# Altium project LM5161 Buck Converter_12Vout.PrjPcb (part 2 of 2)
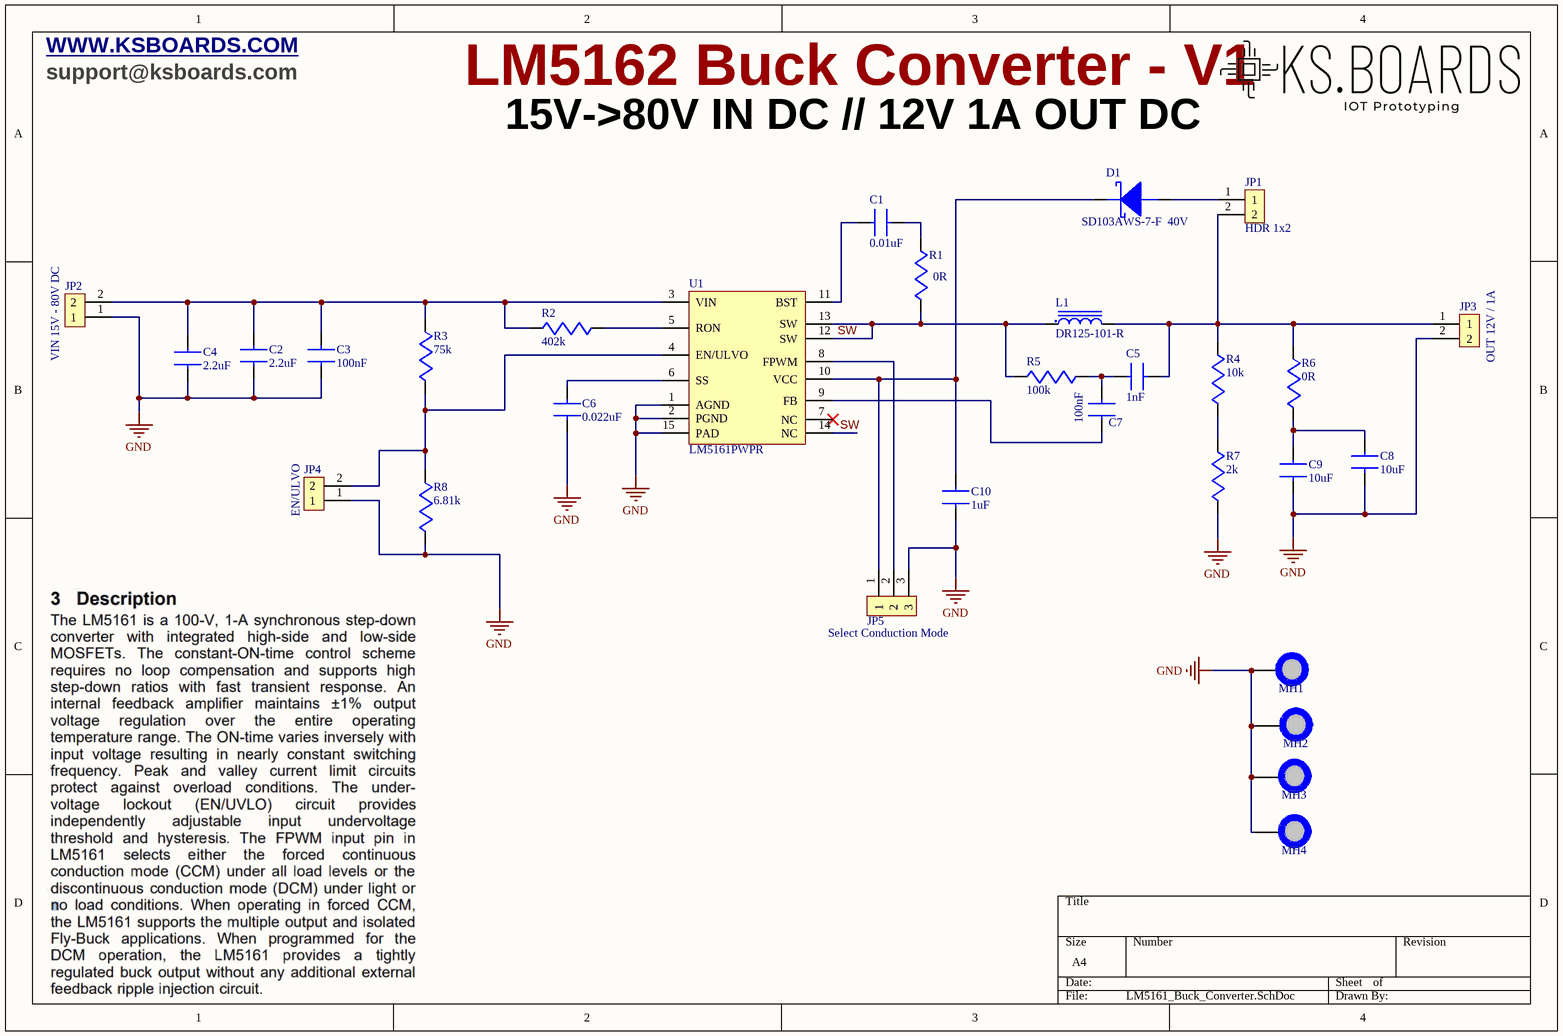
[diagram p1: LM5161_Buck_Converter.SchDoc]

## Sheet LM5161_Buck_Converter.SchDoc (continued)

### Library data of the parts
C1 = C0603X103K5RACTU: KEMET - C0603X103K5RACTU - SMD Multilayer Ceramic Capacitor, FT-CAP, 10000 pF, 50 V, 0603 [1608 Metric], ± 10%, X7R; Capacitance: 10nF; Voltage Rating: 50V; Dissipation Factor: 2.5%; Supplier 1: Digi-Key; Supplier Part Number 1: 399-5346-1-ND; Manufacturer: KEMET; Manufacturer Part Number: C0603X103K5RACTU; RoHS: Yes; Category: Ceramic Capacitors; Stock 1: 40616; Pricing 1: 1=0,36000, 10=0,25000, 50=0,17520, 100=0,15020, 500=0,11262, 1000=0,09510 (USD); Mount: Surface Mount,PCB; Case/Package: 0603; Number of Pins: 2; Case Code (Imperial): 0603; Case Code (Metric): 1608; Dielectric Material: Ceramic; Min Operating Temperature: -55°C; Max Operating Temperature: 125°C; Tolerance: 10%; Packaging: Tape and Reel; Package Quantity: 1; Dielectric: X7R; Voltage Rating (DC): 50V; Termination: SMD/SMT; Series: C0603X; Voltage: 50V; Construction: Flat; Features: Soft Termination; Length: 1.6mm; Width: 0.8mm; Height: 0.8mm; Depth: 0.8mm; Thickness: 0.034inch; Radiation Hardening: No; RoHS Compliant: Yes; REACH SVHC: No SVHC; ComponentLink1URL: https://datasheet.ciiva.com/22700/kem-c1002-x7r-smd-22700565.pdf?src-supplier=Element14; ComponentLink1Description: https://datasheet.ciiva.com/22700/kem-c1002-x7r-smd-22700565.pdf?src-supplier=Element14; ComponentLink2URL: https://datasheet.ciiva.com/28610/1918693-28610825.pdf?src-supplier=Element14; ComponentLink2Description: https://datasheet.ciiva.com/28610/1918693-28610825.pdf?src-supplier=Element14; ComponentLink3URL: https://datasheet.ciiva.com/14604/70096394-14604427.pdf?src-supplier=Allied+Electronics; ComponentLink3Description: https://datasheet.ciiva.com/14604/70096394-14604427.pdf?src-supplier=Allied+Electronics; ComponentLink4URL: https://datasheet.ciiva.com/5904/kem-c1002-x7r-smd-5904908.pdf?src-supplier=Farnell; ComponentLink4Description: https://datasheet.ciiva.com/5904/kem-c1002-x7r-smd-5904908.pdf?src-supplier=Farnell; ComponentLink5URL: https://datasheet.ciiva.com/18193/getdatasheetpartid-571854-18193228.pdf?src-supplier=Verical; ComponentLink5Description: https://datasheet.ciiva.com/18193/getdatasheetpartid-571854-18193228.pdf?src-supplier=Verical; ComponentLink6URL: https://datasheet.ciiva.com/26847/getdatasheetpartid-385605-26847756.pdf?src-supplier=Verical; ComponentLink6Description: https://datasheet.ciiva.com/26847/getdatasheetpartid-385605-26847756.pdf?src-supplier=Verical
C2 C4 = C0603C225K4PACTU: KEMET C0603C225K4PACTU - CAP, MLCC, X5R, 2.2UF, 16V, 0603; Dielectric Material: Ceramic; Tolerance: 10%; Dissipation Factor: 5%; Supplier 1: Digi-Key; Supplier Part Number 1: 399-7886-1-ND; Manufacturer: KEMET; Manufacturer Part Number: C0603C225K4PACTU; RoHS: Yes; Category: Ceramic Capacitors; Stock 1: 245025; Pricing 1: 1=0,13000, 10=0,09000, 50=0,05080, 100=0,04210, 500=0,02952, 1000=0,02444 (USD); Mount: Surface Mount; Case/Package: 0603; Number of Pins: 2; Case Code (Imperial): 0603; Case Code (Metric): 1608; Contact Plating: Tin,Matte; Min Operating Temperature: -55°C; Max Operating Temperature: 85°C; Capacitance: 2.2uF; Voltage Rating (DC): 16V; Packaging: Tape and Reel; Voltage Rating: 16V; Package Quantity: 1; Termination: SMD/SMT; Dielectric: X5R; Voltage: 16V; Series: C; Construction: Flat; Length: 1.6mm; Width: 0.8mm; Height: 0.8mm; Depth: 0.8mm; Thickness: 0.034inch; Radiation Hardening: No; REACH SVHC: No SVHC; RoHS Compliant: Yes; Lead Free: Lead Free; ComponentLink1URL: https://datasheet.ciiva.com/5969/1776083-5969304.pdf?src-supplier=Farnell; ComponentLink1Description: https://datasheet.ciiva.com/5969/1776083-5969304.pdf?src-supplier=Farnell; ComponentLink2URL: https://datasheet.ciiva.com/7823/1776083-7823706.pdf?src-supplier=Element14; ComponentLink2Description: https://datasheet.ciiva.com/7823/1776083-7823706.pdf?src-supplier=Element14
C3 C7 = CC0603KRX7R9BB104: CAPACITOR CERAMIC, 0.1UF, 50V, X7R, 10%, 0603; Manufacturer: Yageo; Supplier 1: Digi-Key; Supplier Part Number 1: 311-1344-1-ND; Manufacturer Part Number: CC0603KRX7R9BB104; RoHS: Yes; Category: Ceramic Capacitors; Stock 1: 8863982; Pricing 1: 1=0,10000, 10=0,05900, 50=0,03240, 100=0,02640, 500=0,01886, 1000=0,01482 (USD); Mount: Surface Mount; Case/Package: 0603; Number of Pins: 2; Case Code (Metric): 1608; Case Code (Imperial): 0603; Dielectric Material: Ceramic; Min Operating Temperature: -55°C; Max Operating Temperature: 125°C; Package Quantity: 1; Capacitance: 100nF; Voltage Rating: 50V; Tolerance: 10%; Packaging: Tape and Reel; Dielectric: X7R; Voltage: 50V; Termination: SMD/SMT; Series: CC; Length: 1.6mm; Width: 0.031inch; Height: 0.8mm; Thickness: 0.035inch; Depth: 0.8mm; Radiation Hardening: No; RoHS Compliant: Yes; Lead Free: Lead Free; REACH SVHC: No SVHC; Halogen Free: Halogen Free; ComponentLink1URL: https://datasheet.ciiva.com/11786/0900766b80d84f1d-11786061.pdf?src-supplier=RSComponents; ComponentLink1Description: https://datasheet.ciiva.com/11786/0900766b80d84f1d-11786061.pdf?src-supplier=RSComponents; ComponentLink2URL: https://datasheet.ciiva.com/144/mlccorderingcode-144176.pdf?src-supplier=Digi-Key; ComponentLink2Description: https://datasheet.ciiva.com/144/mlccorderingcode-144176.pdf?src-supplier=Digi-Key; ComponentLink3URL: https://datasheet.ciiva.com/144/mlccorderingcode-144177.pdf?src-supplier=Digi-Key; ComponentLink3Description: https://datasheet.ciiva.com/144/mlccorderingcode-144177.pdf?src-supplier=Digi-Key; ComponentLink4URL: https://datasheet.ciiva.com/144/mlccorderingcode-144178.pdf?src-supplier=Digi-Key; ComponentLink4Description: https://datasheet.ciiva.com/144/mlccorderingcode-144178.pdf?src-supplier=Digi-Key; ComponentLink5URL: https://datasheet.ciiva.com/7978/1489800-7978166.pdf?src-supplier=Element14; ComponentLink5Description: https://datasheet.ciiva.com/7978/1489800-7978166.pdf?src-supplier=Element14; ComponentLink6URL: https://datasheet.ciiva.com/16625/upy-gphc-x7r-6-3v-to-50v-8-16625530.pdf?src-supplier=Avnet+Europe; ComponentLink6Description: https://datasheet.ciiva.com/16625/upy-gphc-x7r-6-3v-to-50v-8-16625530.pdf?src-supplier=Avnet+Europe; ComponentLink7URL: https://datasheet.ciiva.com/8033/70765-8033819.pdf?src-supplier=Element14; ComponentLink7Description: https://datasheet.ciiva.com/8033/70765-8033819.pdf?src-supplier=Element14; ComponentLink8URL: https://datasheet.ciiva.com/8033/70765-8033821.pdf?src-supplier=Element14; ComponentLink8Description: https://datasheet.ciiva.com/8033/70765-8033821.pdf?src-supplier=Element14; ComponentLink9URL: https://datasheet.ciiva.com/22749/1489800-22749214.pdf?src-supplier=Element14; ComponentLink9Description: https://datasheet.ciiva.com/22749/1489800-22749214.pdf?src-supplier=Element14; ComponentLink10URL: https://datasheet.ciiva.com/31394/1489800-31394927.pdf?src-supplier=Farnell; ComponentLink10Description: https://datasheet.ciiva.com/31394/1489800-31394927.pdf?src-supplier=Farnell
C5 = C0603C102K5RACTU: KEMET - C0603C102K5RACTU - SMD Multilayer Ceramic Capacitor, 1000 pF, 50 V, 0603 [1608 Metric], ± 10%, X7R, C Series KEMET; Voltage Rating: 50V; Dissipation Factor: 2.5%; Supplier 1: Digi-Key; Supplier Part Number 1: 399-1082-1-ND; Manufacturer: KEMET; Manufacturer Part Number: C0603C102K5RACTU; RoHS: Yes; Category: Ceramic Capacitors; Stock 1: 888320; Pricing 1: 1=0,10000, 10=0,06100, 50=0,03320, 100=0,02700, 500=0,01932, 1000=0,01518 (USD); Mount: Surface Mount,PCB; Case/Package: 0603; Number of Pins: 2; Case Code (Imperial): 0603; Case Code (Metric): 1608; Dielectric Material: Ceramic; Contact Plating: Tin,Matte; Min Operating Temperature: -55°C; Max Operating Temperature: 125°C; Capacitance: 1nF; Tolerance: 10%; Packaging: Tape and Reel; Package Quantity: 1; Voltage Rating (DC): 50V; Termination: SMD/SMT; Dielectric: X7R; Series: C; Voltage: 50V; Construction: Flat; Length: 1.6mm; Width: 0.8mm; Height: 0.8mm; Thickness: 0.034inch; Depth: 0.8mm; Lead Pitch: 0.7mm; Radiation Hardening: No; RoHS Compliant: Yes; REACH SVHC: No SVHC; ComponentLink1URL: https://datasheet.ciiva.com/14589/70095383-14589013.pdf?src-supplier=Allied+Electronics; ComponentLink1Description: https://datasheet.ciiva.com/14589/70095383-14589013.pdf?src-supplier=Allied+Electronics; ComponentLink2URL: https://datasheet.ciiva.com/18192/getdatasheetpartid-110033-18192647.pdf?src-supplier=Verical; ComponentLink2Description: https://datasheet.ciiva.com/18192/getdatasheetpartid-110033-18192647.pdf?src-supplier=Verical; ComponentLink3URL: https://datasheet.ciiva.com/22749/1918693-22749719.pdf?src-supplier=Element14; ComponentLink3Description: https://datasheet.ciiva.com/22749/1918693-22749719.pdf?src-supplier=Element14; ComponentLink4URL: https://datasheet.ciiva.com/14586/70095383-14586057.pdf?src-supplier=Allied+Electronics; ComponentLink4Description: https://datasheet.ciiva.com/14586/70095383-14586057.pdf?src-supplier=Allied+Electronics; ComponentLink5URL: https://datasheet.ciiva.com/28645/1851736-28645563.pdf?src-supplier=Element14; ComponentLink5Description: https://datasheet.ciiva.com/28645/1851736-28645563.pdf?src-supplier=Element14
C6 = C0603C223K4RACTU: Cap Ceramic 0.022uF 16V X7R 10% SMD 0603 125°C Paper T/R; Manufacturer: KEMET; Capacitance: 22nF; Supplier 1: Digi-Key; Supplier Part Number 1: 399-1093-1-ND; Manufacturer Part Number: C0603C223K4RACTU; RoHS: Yes; Category: Ceramic Capacitors; Stock 1: 127241; Pricing 1: 1=0,10000, 10=0,06300, 50=0,03440, 100=0,02820, 500=0,02012, 1000=0,01581 (USD); Mount: Surface Mount; Case/Package: 0603; Case Code (Imperial): 0603; Case Code (Metric): 1608; Weight: 7.1E-05oz; Min Operating Temperature: -55°C; Max Operating Temperature: 125°C; Packaging: Tape and Reel; Tolerance: 10%; Voltage Rating: 16V; Package Quantity: 1; Dielectric: X7R; Voltage Rating (DC): 16V; Termination: SMD/SMT; Series: C; Construction: Flat; Length: 1.6mm; Width: 0.8mm; Height: 0.8mm; Thickness: 0.034inch; Depth: 0.8mm; Radiation Hardening: No; RoHS Compliant: Yes; REACH SVHC: No SVHC; ComponentLink1URL: https://datasheet.ciiva.com/26847/getdatasheetpartid-724406-26847612.pdf?src-supplier=Verical; ComponentLink1Description: https://datasheet.ciiva.com/26847/getdatasheetpartid-724406-26847612.pdf?src-supplier=Verical; ComponentLink2URL: https://datasheet.ciiva.com/14599/70095383-14599397.pdf?src-supplier=Allied+Electronics; ComponentLink2Description: https://datasheet.ciiva.com/14599/70095383-14599397.pdf?src-supplier=Allied+Electronics; ComponentLink3URL: https://datasheet.ciiva.com/49516/1636924-49516646.pdf?src-supplier=Jameco; ComponentLink3Description: https://datasheet.ciiva.com/49516/1636924-49516646.pdf?src-supplier=Jameco; ComponentLink4URL: https://datasheet.ciiva.com/14601/70095383-14601245.pdf?src-supplier=Allied+Electronics; ComponentLink4Description: https://datasheet.ciiva.com/14601/70095383-14601245.pdf?src-supplier=Allied+Electronics
C8 C9 = C0603C106M9PACTU: KEMET - C0603C106M9PACTU - CAP, MLCC, X5R, 10UF, 6.3V, 0603; Dielectric Material: Ceramic; Tolerance: 20%; Supplier 1: Digi-Key; Supplier Part Number 1: 399-5504-1-ND; Manufacturer: KEMET; Manufacturer Part Number: C0603C106M9PACTU; RoHS: Yes; Category: Ceramic Capacitors; Stock 1: 524749; Pricing 1: 1=0,32000, 10=0,22000, 50=0,14680, 100=0,12470, 500=0,08804, 1000=0,07704 (USD); Mount: PCB,Surface Mount; Case/Package: 0603; Number of Pins: 2; Case Code (Imperial): 0603; Case Code (Metric): 1608; Min Operating Temperature: -55°C; Max Operating Temperature: 85°C; Capacitance: 10uF; Packaging: Tape and Reel; Voltage: 6.3V; Termination: SMD/SMT; Package Quantity: 4000; Voltage Rating: 6.3V; Voltage Rating (DC): 6.3V; Series: C0603C; Dielectric: X5R; Construction: Flat; Length: 1.6mm; Height: 0.8mm; Depth: 0.8mm; Radiation Hardening: No; REACH SVHC: No SVHC; RoHS Compliant: Yes; ComponentLink1URL: http://www.farnell.com/datasheets/2739682.pdf?src-supplier=Farnell; ComponentLink1Description: http://www.farnell.com/datasheets/2739682.pdf?src-supplier=Farnell; ComponentLink2URL: http://uk.rs-online.com/webdocs/1515/0900766b8151511d.pdf?src-supplier=RSComponents; ComponentLink2Description: http://uk.rs-online.com/webdocs/1515/0900766b8151511d.pdf?src-supplier=RSComponents; ComponentLink3URL: http://www.farnell.com/datasheets/1918694.pdf?src-supplier=Farnell; ComponentLink3Description: http://www.farnell.com/datasheets/1918694.pdf?src-supplier=Farnell; ComponentLink4URL: http://components.arrow.com/part/dataview/0323_00011321?src-supplier=Arrow+Europe; ComponentLink4Description: http://components.arrow.com/part/dataview/0323_00011321?src-supplier=Arrow+Europe; ComponentLink5URL: https://www.verical.com/server-webapp/html/getDatasheet?partID=353664&src-supplier=Verical; ComponentLink5Description: https://www.verical.com/server-webapp/html/getDatasheet?partID=353664&src-supplier=Verical; ComponentLink6URL: http://components.arrow.com/part/dataview/42932973S8313645N7429?src-supplier=Arrow+Electronics; ComponentLink6Description: http://components.arrow.com/part/dataview/42932973S8313645N7429?src-supplier=Arrow+Electronics; ComponentLink7URL: http://www.farnell.com/datasheets/2315129.pdf?src-supplier=Allied+Electronics; ComponentLink7Description: http://www.farnell.com/datasheets/2315129.pdf?src-supplier=Allied+Electronics; ComponentLink8URL: http://www.farnell.com/datasheets/2315129.pdf?src-supplier=RSComponents; ComponentLink8Description: http://www.farnell.com/datasheets/2315129.pdf?src-supplier=RSComponents; ComponentLink9URL: https://api.kemet.com/component-edge/download/datasheet/C0603C106M9PACTU.pdf?src-supplier=Digi-Key; ComponentLink9Description: https://api.kemet.com/component-edge/download/datasheet/C0603C106M9PACTU.pdf?src-supplier=Digi-Key; ComponentLink10URL: http://www.kemet.com/kemet/web/homepage/kechome.nsf/weben/ADB5E2666EC6BA90CA2570A50016092E/$file/KEM_C1005_Y5V_SMD.pdf?src-supplier=Avnet; ComponentLink10Description: http://www.kemet.com/kemet/web/homepage/kechome.nsf/weben/ADB5E2666EC6BA90CA2570A50016092E/$file/KEM_C1005_Y5V_SMD.pdf?src-supplier=Avnet; ComponentLink11URL: http://www.farnell.com/datasheets/2315129.pdf?src-supplier=Verical; ComponentLink11Description: http://www.farnell.com/datasheets/2315129.pdf?src-supplier=Verical; ComponentLink12URL: http://www.farnell.com/datasheets/2739682.pdf?src-supplier=Newark; ComponentLink12Description: http://www.farnell.com/datasheets/2739682.pdf?src-supplier=Newark; ComponentLink13URL: http://www.farnell.com/datasheets/2739682.pdf?src-supplier=Element14; ComponentLink13Description: http://www.farnell.com/datasheets/2739682.pdf?src-supplier=Element14; ComponentLink14URL: http://www.farnell.com/datasheets/2315129.pdf?src-supplier=Distrelec; ComponentLink14Description: http://www.farnell.com/datasheets/2315129.pdf?src-supplier=Distrelec; ComponentLink15URL: http://www.farnell.com/datasheets/2315129.pdf?src-supplier=Avnet+Asia; ComponentLink15Description: http://www.farnell.com/datasheets/2315129.pdf?src-supplier=Avnet+Asia; ComponentLink16URL: http://www.farnell.com/datasheets/2315129.pdf?src-supplier=Mouser; ComponentLink16Description: http://www.farnell.com/datasheets/2315129.pdf?src-supplier=Mouser; ComponentLink17URL: http://www.kemet.com/kemet/web/homepage/kechome.nsf/file/Commercial%20Ceramic%20Chips%20X5R%20Dielectric/$file/KEM_C1006_X5R_SMD.pdf?src-supplier=Element14; ComponentLink17Description: http://www.kemet.com/kemet/web/homepage/kechome.nsf/file/Commercial%20Ceramic%20Chips%20X5R%20Dielectric/$file/KEM_C1006_X5R_SMD.pdf?src-supplier=Element14; ComponentLink18URL: http://capacitoredge.kemet.com/capedge2/DataSheet?pn=C0603C106M9PAC7867&src-supplier=Avnet; ComponentLink18Description: http://capacitoredge.kemet.com/capedge2/DataSheet?pn=C0603C106M9PAC7867&src-supplier=Avnet; ComponentLink19URL: http://www.farnell.com/datasheets/2315129.pdf?src-supplier=Quest; ComponentLink19Description: http://www.farnell.com/datasheets/2315129.pdf?src-supplier=Quest; ComponentLink20URL: http://www.farnell.com/datasheets/2315129.pdf?src-supplier=TTI; ComponentLink20Description: http://www.farnell.com/datasheets/2315129.pdf?src-supplier=TTI; ComponentLink21URL: http://www.farnell.com/datasheets/2315129.pdf?src-supplier=TME; ComponentLink21Description: http://www.farnell.com/datasheets/2315129.pdf?src-supplier=TME
C10 = C0603C105K3PACTU: KEMET - C0603C105K3PACTU - SMD Multilayer Ceramic Capacitor, 1 µF, 25 V, 0603 [1608 Metric], ± 10%, X5R, C Series KEMET; Voltage Rating: 25V; Supplier 1: Digi-Key; Supplier Part Number 1: 399-7846-1-ND; Manufacturer: KEMET; Manufacturer Part Number: C0603C105K3PACTU; RoHS: Yes; Category: Ceramic Capacitors; Stock 1: 91592; Pricing 1: 1=0,19000, 10=0,13300, 50=0,07540, 100=0,06250, 500=0,04384, 1000=0,03630 (USD); Mount: Surface Mount,PCB; Case/Package: 0603; Number of Pins: 2; Case Code (Imperial): 0603; Case Code (Metric): 1608; Dielectric Material: Ceramic; Contact Plating: Tin,Matte; Min Operating Temperature: -55°C; Max Operating Temperature: 85°C; Capacitance: 1uF; Tolerance: 10%; Packaging: Tape and Reel; Package Quantity: 4000; Termination: SMD/SMT; Voltage Rating (DC): 25V; Dielectric: X5R; Voltage: 25V; Series: C0603C; Construction: Flat; Length: 1.6mm; Width: 0.031inch; Height: 0.8mm; Depth: 0.8mm; Thickness: 0.034inch; Radiation Hardening: No; REACH SVHC: No SVHC; RoHS Compliant: Yes; Lead Free: Lead Free; ComponentLink1URL: https://datasheet.ciiva.com/28610/1918694-28610792.pdf?src-supplier=Element14; ComponentLink1Description: https://datasheet.ciiva.com/28610/1918694-28610792.pdf?src-supplier=Element14; ComponentLink2URL: https://datasheet.ciiva.com/5998/40889-5998745.pdf?src-supplier=Farnell; ComponentLink2Description: https://datasheet.ciiva.com/5998/40889-5998745.pdf?src-supplier=Farnell
D1 = SD103AWS-7-F: Diode Schottky 40V 0.35A Automotive 2-Pin SOD-323 T/R; Manufacturer: Diodes; Forward Current: 350mA; Peak Non-Repetitive Surge Current: 1.5A; Element Configuration: Single; Forward Voltage: 600mV; Max Power Dissipation: 200mW; Max Reverse Current: 5uA; Reverse Recovery Time: 10ns; Polarity: Standard; Capacitance: 28pF; Current: 15A; Supplier 1: Digi-Key; Supplier Part Number 1: SD103AWS-FDICT-ND; Manufacturer Part Number: SD103AWS-7-F; RoHS: Yes; Category: Schottky Diodes; Stock 1: 26272; Pricing 1: 1=0,39000, 10=0,27400, 100=0,13830, 500=0,12258, 1000=0,09540 (USD); Mount: Surface Mount; Number of Pins: 2; Weight: 0.000173oz; Contact Plating: Tin,Matte; Min Operating Temperature: -65°C; Max Operating Temperature: 125°C; Max Repetitive Reverse Voltage (Vrrm): 40V; Packaging: Tape and Reel; Package Quantity: 3000; Average Rectified Current: 350mA; Max Forward Surge Current (Ifsm): 1.5A; Power Dissipation: 200mW; Termination: SMD/SMT; Voltage Rating (DC): 40V; Power Rating: 200mW; Current Rating: 350mA; Output Current: 350mA; Voltage: 40V; Max Reverse Voltage (DC): 40V; Series: -; Length: 1.8mm; Width: 1.4mm; Height: 1mm; Radiation Hardening: No; REACH SVHC: No SVHC; Lead Free: Lead Free; RoHS Compliant: Yes; ComponentLink1URL: https://datasheet.ciiva.com/34302/1541917-34302427.pdf?src-supplier=Jameco; ComponentLink1Description: https://datasheet.ciiva.com/34302/1541917-34302427.pdf?src-supplier=Jameco; ComponentLink2URL: https://datasheet.ciiva.com/17068/0900766b80e30fe8-17068236.pdf?src-supplier=Allied+Electronics; ComponentLink2Description: https://datasheet.ciiva.com/17068/0900766b80e30fe8-17068236.pdf?src-supplier=Allied+Electronics; ComponentLink3URL: https://datasheet.ciiva.com/15144/getdatasheetpartid-89223-15144637.pdf?src-supplier=Verical; ComponentLink3Description: https://datasheet.ciiva.com/15144/getdatasheetpartid-89223-15144637.pdf?src-supplier=Verical; ComponentLink4URL: https://datasheet.ciiva.com/912/ds30101-912900.pdf?src-supplier=Digi-Key; ComponentLink4Description: https://datasheet.ciiva.com/912/ds30101-912900.pdf?src-supplier=Digi-Key; ComponentLink5URL: https://datasheet.ciiva.com/912/ds30101-912901.pdf?src-supplier=Digi-Key; ComponentLink5Description: https://datasheet.ciiva.com/912/ds30101-912901.pdf?src-supplier=Digi-Key; ComponentLink6URL: https://datasheet.ciiva.com/16476/ds30101-16476773.pdf?src-supplier=Avnet+Asia; ComponentLink6Description: https://datasheet.ciiva.com/16476/ds30101-16476773.pdf?src-supplier=Avnet+Asia; ComponentLink7URL: https://datasheet.ciiva.com/912/ds30101-912902.pdf?src-supplier=Digi-Key; ComponentLink7Description: https://datasheet.ciiva.com/912/ds30101-912902.pdf?src-supplier=Digi-Key; ComponentLink8URL: https://datasheet.ciiva.com/22695/1911709-22695846.pdf?src-supplier=Element14; ComponentLink8Description: https://datasheet.ciiva.com/22695/1911709-22695846.pdf?src-supplier=Element14; ComponentLink9URL: https://datasheet.ciiva.com/7964/ds30101-7964328.pdf?src-supplier=Element14; ComponentLink9Description: https://datasheet.ciiva.com/7964/ds30101-7964328.pdf?src-supplier=Element14; ComponentLink10URL: https://datasheet.ciiva.com/8301/ds30101-8301401.pdf?src-supplier=Avnet; ComponentLink10Description: https://datasheet.ciiva.com/8301/ds30101-8301401.pdf?src-supplier=Avnet; ComponentLink11URL: https://datasheet.ciiva.com/25945/ds30101-25945898.pdf?src-supplier=Avnet+Europe; ComponentLink11Description: https://datasheet.ciiva.com/25945/ds30101-25945898.pdf?src-supplier=Avnet+Europe
JP1-JP4 = 1729128: TERMINAL BLOCK, WIRE TO BRD, 2POS, 16AWG; Manufacturer: Phoenix Contact; Voltage Rating: 400V; Current Rating: 13.5A; Number of Positions: 2; Connector Type: Screw; Number of Levels: 1; Current: 10A; Voltage: 300V; Test Voltage: 4kV; Pitch: 5.08mm; Wire Gauge (Max): 26AWG; Wire Gauge (Min): 14AWG; Approvals: UL,CSA; Supplier 1: Digi-Key; Supplier Part Number 1: 277-1247-ND; Manufacturer Part Number: 1729128; RoHS: Yes; Category: Terminal Blocks; Stock 1: 22255; Pricing 1: 1=1,09000, 10=1,04700, 50=1,00100, 100=0,97370, 250=0,91000, 500=0,83720, 1000=0,77350, 2500=0,73710, 5000=0,69160 (USD); Mount: Through Hole; Number of Pins: 2; Color: Green; Housing Color: Green; Housing Material: Polyamide; Contact Material: Tin; Weight: 0.069842oz; Insulation Material: Nylon; Min Operating Temperature: -20°C; Max Operating Temperature: 100°C; Packaging: Bulk; Termination: Solder; Number of Poles: 2; Package Quantity: 50; Number of Contacts: 2; Orientation: Straight; Series: MKDSN; Number of Rows: 1; Number of Positions Per Level: 2; Max Current Rating: 13.5A; Max Supply Voltage: 400V; Number of Circuits: 2; Length: 8.1mm; Width: 13.5mm; Height: 13.5mm; Depth: 8.1mm; Wire/Cable Gauge: 26AWG; Radiation Hardening: No; REACH SVHC: No SVHC; Flammability Rating: UL94 V-0; RoHS Compliant: Yes; Lead Free: Lead Free; ComponentLink1URL: https://datasheet.ciiva.com/823/1729128-823779.pdf?src-supplier=Digi-Key; ComponentLink1Description: https://datasheet.ciiva.com/823/1729128-823779.pdf?src-supplier=Digi-Key; ComponentLink2URL: https://datasheet.ciiva.com/15169/getdatasheetpartid-199310-15169845.pdf?src-supplier=Verical; ComponentLink2Description: https://datasheet.ciiva.com/15169/getdatasheetpartid-199310-15169845.pdf?src-supplier=Verical; ComponentLink3URL: https://datasheet.ciiva.com/16046/1729128-16046181.pdf?src-supplier=Onlinecomponents.com; ComponentLink3Description: https://datasheet.ciiva.com/16046/1729128-16046181.pdf?src-supplier=Onlinecomponents.com; ComponentLink4URL: https://datasheet.ciiva.com/14607/70054405-14607157.pdf?src-supplier=Allied+Electronics; ComponentLink4Description: https://datasheet.ciiva.com/14607/70054405-14607157.pdf?src-supplier=Allied+Electronics; ComponentLink5URL: https://datasheet.ciiva.com/29218/743664-da-01-en-printklemmenblock-mkdsn-1-5-2-5-08-29218154.pdf?src-supplier=Conrad; ComponentLink5Description: https://datasheet.ciiva.com/29218/743664-da-01-en-printklemmenblock-mkdsn-1-5-2-5-08-29218154.pdf?src-supplier=Conrad
JP5 = 1765344: MSTB 2 5/ 3-ST BD: 1-3; Manufacturer: Phoenix Contact; Voltage Rating: 250V; Max Current Rating: 12A; Number of Positions: 3; Number of Levels: 1; Current: 15A; Voltage: 300V; Gender: Female; Connector Type: Screw; Pitch: 5mm; Wire Gauge (Max): 12AWG; Wire Gauge (Min): 24AWG; Stripping Length: 7mm; Supplier 1: Digi-Key; Supplier Part Number 1: 277-1958-ND; Manufacturer Part Number: 1765344; RoHS: Yes; Category: Terminal Blocks; Stock 1: 3; Pricing 1: 1=3,07000, 10=2,98500, 50=2,79000, 100=2,56680, 250=2,37148, 500=2,25990, 1000=2,12040 (USD); Mount: Free Hanging,Plug-In; Color: Green; Contact Plating: Tin; Weight: 4.409lb; Housing Color: Green; Housing Material: Plastic; Contact Material: Tin; Material: Polyamide; Package Quantity: 50; Packaging: Bulk; Termination: Screw; Series: COMBICON MSTB; Current Rating: 12A; Number of Positions Per Level: 3; Number of Contacts: 3; Number of Poles: 3; Number of Rows: 1; Length: 15mm; Width: 18.2mm; Height: 15mm; RoHS Compliant: Yes; Flammability Rating: UL94 V-0; ComponentLink1URL: https://datasheet.ciiva.com/16046/1765344-16046432.pdf?src-supplier=Onlinecomponents.com; ComponentLink1Description: https://datasheet.ciiva.com/16046/1765344-16046432.pdf?src-supplier=Onlinecomponents.com; ComponentLink2URL: https://datasheet.ciiva.com/795/1765344-795481.pdf?src-supplier=Digi-Key; ComponentLink2Description: https://datasheet.ciiva.com/795/1765344-795481.pdf?src-supplier=Digi-Key
L1 = DR125-101-R: Inductor Power Shielded Drum Core 102.7uH/100uH 20% 100KHz Ferrite 1.78A 170mOhm DCR T/R; Manufacturer: Eaton Cooper; Inductance: 100uH; Max DC Current: 2.2A; DC Resistance (DCR): 170mR; Supplier 1: Digi-Key; Supplier Part Number 1: 513-1526-1-ND; Manufacturer Part Number: DR125-101-R; RoHS: Yes; Category: Fixed Inductors; Stock 1: 598; Pricing 1: 1=1,22000, 10=1,13800, 25=1,05000, 50=0,87500, 100=0,82250, 250=0,73500 (USD); Mount: Surface Mount; Case/Package: Nonstandard; Core Material: Ferrite; Weight: 0.144oz; Min Operating Temperature: -40°C; Max Operating Temperature: 125°C; Tolerance: 20%; Packaging: Tape and Reel; Inductance Tolerance: 20%; Shielding: Shielded; Package Quantity: 600; Current Rating: 1.78A; Saturation Current: 2.2A; Termination: SMD/SMT; Test Frequency: 100kHz; Resistor Type: Wirewound; Self Resonant Frequency: 100kHz; RMS Current (Irms): 1.78A; DC Current: 1.78A; Series: DR; Rated Current-Max: 1.78A; Length: 12.5mm; Width: 12.5mm; Height: 6mm; Height - Seated (Max): 0.236inch; Depth: 12.5mm; Radiation Hardening: No; REACH SVHC: No SVHC; Military Standard: Not; Lead Free: Lead Free; RoHS Compliant: Yes; ComponentLink1URL: https://datasheet.ciiva.com/14667/0900766b8116a153-14667792.pdf?src-supplier=RSComponents; ComponentLink1Description: https://datasheet.ciiva.com/14667/0900766b8116a153-14667792.pdf?src-supplier=RSComponents; ComponentLink2URL: https://datasheet.ciiva.com/26858/getdatasheetpartid-246996-26858383.pdf?src-supplier=Verical; ComponentLink2Description: https://datasheet.ciiva.com/26858/getdatasheetpartid-246996-26858383.pdf?src-supplier=Verical; ComponentLink3URL: https://datasheet.ciiva.com/16941/70037876-16941189.pdf?src-supplier=Allied+Electronics; ComponentLink3Description: https://datasheet.ciiva.com/16941/70037876-16941189.pdf?src-supplier=Allied+Electronics; ComponentLink4URL: https://datasheet.ciiva.com/4958/bus-elx-ds-4315-dr-series-4958744.pdf?src-supplier=Mouser; ComponentLink4Description: https://datasheet.ciiva.com/4958/bus-elx-ds-4315-dr-series-4958744.pdf?src-supplier=Mouser; ComponentLink5URL: https://datasheet.ciiva.com/8004/87246-8004859.pdf?src-supplier=Element14; ComponentLink5Description: https://datasheet.ciiva.com/8004/87246-8004859.pdf?src-supplier=Element14; ComponentLink6URL: https://datasheet.ciiva.com/16209/bus-elx-ds-4315-dr-series-16209711.pdf?src-supplier=Future+Electronics; ComponentLink6Description: https://datasheet.ciiva.com/16209/bus-elx-ds-4315-dr-series-16209711.pdf?src-supplier=Future+Electronics
MH1-MH4 = MH_3.5MM_3.5MM: Mounting hole 3.5mm diameter 2mm drill hole
R1 R6 = CRCW06030000Z0EC: VISHAY - CRCW06030000Z0EC - RES, AEC-Q200, THICK FILM, 0R, 0.1W, 0603; Manufacturer: Vishay Dale; Power Rating: 100mW; Supplier 1: Digi-Key; Supplier Part Number 1: 541-2969-1-ND; Manufacturer Part Number: CRCW06030000Z0EC; RoHS: Yes; Category: Chip SMD Resistors; Stock 1: 17802; Pricing 1: 1=0,10000, 10=0,02800, 25=0,02040, 50=0,01540, 100=0,01140, 250=0,00868, 500=0,00694, 1000=0,00511, 5000=0,00367 (USD); Mount: Surface Mount; Case/Package: 0603; Case Code (Metric): 1608; Case Code (Imperial): 0603; Contact Plating: Tin; Min Operating Temperature: -55°C; Max Operating Temperature: 155°C; Resistance: 0R; Packaging: Tape and Reel; Resistor Type: Thick Film; Series: CRCW; Construction: Rectangular; Max Power Dissipation: 100mW; Number of Terminations: 2; Features: Automotive AEC-Q200; Length: 0.061inch; Width: 0.033inch; Height: 0.02inch; Depth: 0.85mm; Radiation Hardening: No; Military Standard: Not; RoHS Compliant: Yes; Lead Free: Lead Free; ComponentLink1URL: https://datasheet.ciiva.com/16199/dcrcwe3-16199083.pdf?src-supplier=Future+Electronics; ComponentLink1Description: https://datasheet.ciiva.com/16199/dcrcwe3-16199083.pdf?src-supplier=Future+Electronics
R2 = CRCW0603402KFKEA: Res Thick Film 0603 402K Ohm 1% 0.1W(1/10W) ±100ppm/C Molded SMD Automotive Paper T/R; Manufacturer: Vishay; Resistance: 402kR; Power Rating: 100mW; Voltage Rating (DC): 75V; Temperature Coefficient: 100ppm/°C; Supplier 1: Digi-Key; Supplier Part Number 1: 541-402KHCT-ND; Manufacturer Part Number: CRCW0603402KFKEA; RoHS: Yes; Category: Chip SMD Resistors; Stock 1: 11071; Pricing 1: 1=0,10000, 10=0,03600, 100=0,01450, 1000=0,00652, 2500=0,00566 (USD); Case/Package: 0603; Number of Pins: 2; Case Code (Metric): 1608; Case Code (Imperial): 0603; Contact Plating: Tin; Weight: 7.1E-05oz; Size Code: 0603; Min Operating Temperature: -55°C; Max Operating Temperature: 155°C; Packaging: Tape and Reel; Package Quantity: 10; Termination: SMD/SMT; Tolerance: 1%; Max Power Dissipation: 100mW; Voltage Rating: 75V; Resistor Type: Thick Film; Number of Terminations: 2; Series: CRCW; Resistance Tolerance: 1%; Features: Automotive AEC-Q200; Construction: Rectangular; Technology: THICK FILM; Length: 1.55mm; Width: 0.033inch; Height: 0.45mm; Depth: 0.85mm; Radiation Hardening: No; REACH SVHC: Unknown; Lead Free: Lead Free; RoHS Compliant: Yes; Military Standard: Not; ComponentLink1URL: https://datasheet.ciiva.com/2466/dcrcwe3-2466641.pdf?src-supplier=Digi-Key; ComponentLink1Description: https://datasheet.ciiva.com/2466/dcrcwe3-2466641.pdf?src-supplier=Digi-Key; ComponentLink2URL: https://datasheet.ciiva.com/2466/dcrcwe3-2466642.pdf?src-supplier=Digi-Key; ComponentLink2Description: https://datasheet.ciiva.com/2466/dcrcwe3-2466642.pdf?src-supplier=Digi-Key; ComponentLink3URL: https://datasheet.ciiva.com/2466/dcrcwe3-2466643.pdf?src-supplier=Digi-Key; ComponentLink3Description: https://datasheet.ciiva.com/2466/dcrcwe3-2466643.pdf?src-supplier=Digi-Key; ComponentLink4URL: https://datasheet.ciiva.com/3257/dcrcwe3-3257561.pdf?src-supplier=Avnet; ComponentLink4Description: https://datasheet.ciiva.com/3257/dcrcwe3-3257561.pdf?src-supplier=Avnet; ComponentLink5URL: https://datasheet.ciiva.com/16427/dcrcwe3-16427337.pdf?src-supplier=Future+Electronics; ComponentLink5Description: https://datasheet.ciiva.com/16427/dcrcwe3-16427337.pdf?src-supplier=Future+Electronics; ComponentLink6URL: https://datasheet.ciiva.com/16769/70201119-16769689.pdf?src-supplier=Allied+Electronics; ComponentLink6Description: https://datasheet.ciiva.com/16769/70201119-16769689.pdf?src-supplier=Allied+Electronics; ComponentLink7URL: https://datasheet.ciiva.com/5541/dcrcwe3-109170-5541596.pdf?src-supplier=Mouser; ComponentLink7Description: https://datasheet.ciiva.com/5541/dcrcwe3-109170-5541596.pdf?src-supplier=Mouser; ComponentLink8URL: https://datasheet.ciiva.com/7792/125364-7792268.pdf?src-supplier=Element14; ComponentLink8Description: https://datasheet.ciiva.com/7792/125364-7792268.pdf?src-supplier=Element14; ComponentLink9URL: https://datasheet.ciiva.com/22705/1697337-22705964.pdf?src-supplier=Element14; ComponentLink9Description: https://datasheet.ciiva.com/22705/1697337-22705964.pdf?src-supplier=Element14; ComponentLink10URL: https://datasheet.ciiva.com/7674/1697337-7674093.pdf?src-supplier=Element14; ComponentLink10Description: https://datasheet.ciiva.com/7674/1697337-7674093.pdf?src-supplier=Element14; ComponentLink11URL: https://datasheet.ciiva.com/7674/1697337-7674094.pdf?src-supplier=Element14; ComponentLink11Description: https://datasheet.ciiva.com/7674/1697337-7674094.pdf?src-supplier=Element14
R3 = CRCW060375K0FKEA: Resistor;  Thick Film;  75 Kilohms;  0.1 W;  1%;  SMT;  0603;  TCR 37 ppm/DegC; Manufacturer: Vishay; Voltage Rating (DC): 75V; Power Rating: 100mW; Resistance: 75kR; Temperature Coefficient: 100ppm/°C; Supplier 1: Digi-Key; Supplier Part Number 1: 541-75.0KHCT-ND; Manufacturer Part Number: CRCW060375K0FKEA; RoHS: Yes; Category: Chip SMD Resistors; Stock 1: 9117; Pricing 1: 1=0,10000, 10=0,03600, 100=0,01450, 1000=0,00652, 2500=0,00566 (USD); Mount: Surface Mount; Case/Package: 0603; Number of Pins: 2; Contact Plating: Tin; Case Code (Metric): 1608; Case Code (Imperial): 0603; Weight: 7.1E-05oz; Size Code: 0603; Min Operating Temperature: -55°C; Max Operating Temperature: 155°C; Packaging: Tape and Reel; Package Quantity: 10; Series: CRCW; Tolerance: 1%; Max Power Dissipation: 100mW; Resistor Type: Thick Film; Voltage Rating: 75V; Number of Terminations: 2; Termination: SMD/SMT; Resistance Tolerance: 1%; Technology: THICK FILM; Construction: Rectangular; Features: Automotive AEC-Q200; Length: 1.55mm; Width: 0.033inch; Height: 0.45mm; Depth: 0.85mm; Radiation Hardening: No; REACH SVHC: Unknown; RoHS Compliant: Yes; Lead Free: Lead Free; Military Standard: Not; ComponentLink1URL: https://datasheet.ciiva.com/11818/0900766b80d98afc-11818189.pdf?src-supplier=RSComponents; ComponentLink1Description: https://datasheet.ciiva.com/11818/0900766b80d98afc-11818189.pdf?src-supplier=RSComponents; ComponentLink2URL: https://datasheet.ciiva.com/16884/dcrcwe3-16884213.pdf?src-supplier=Avnet+Europe; ComponentLink2Description: https://datasheet.ciiva.com/16884/dcrcwe3-16884213.pdf?src-supplier=Avnet+Europe; ComponentLink3URL: https://datasheet.ciiva.com/26314/fld-crcw-e3-data-en-26314678.pdf?src-supplier=Distrelec; ComponentLink3Description: https://datasheet.ciiva.com/26314/fld-crcw-e3-data-en-26314678.pdf?src-supplier=Distrelec; ComponentLink4URL: https://datasheet.ciiva.com/2494/dcrcwe3-2494759.pdf?src-supplier=Digi-Key; ComponentLink4Description: https://datasheet.ciiva.com/2494/dcrcwe3-2494759.pdf?src-supplier=Digi-Key; ComponentLink5URL: https://datasheet.ciiva.com/2494/dcrcwe3-2494760.pdf?src-supplier=Digi-Key; ComponentLink5Description: https://datasheet.ciiva.com/2494/dcrcwe3-2494760.pdf?src-supplier=Digi-Key; ComponentLink6URL: https://datasheet.ciiva.com/16787/70201119-16787192.pdf?src-supplier=Allied+Electronics; ComponentLink6Description: https://datasheet.ciiva.com/16787/70201119-16787192.pdf?src-supplier=Allied+Electronics; ComponentLink7URL: https://datasheet.ciiva.com/2494/dcrcwe3-2494761.pdf?src-supplier=Digi-Key; ComponentLink7Description: https://datasheet.ciiva.com/2494/dcrcwe3-2494761.pdf?src-supplier=Digi-Key; ComponentLink8URL: https://datasheet.ciiva.com/3257/dcrcwe3-3257881.pdf?src-supplier=Avnet; ComponentLink8Description: https://datasheet.ciiva.com/3257/dcrcwe3-3257881.pdf?src-supplier=Avnet; ComponentLink9URL: https://datasheet.ciiva.com/7673/1697337-7673321.pdf?src-supplier=Element14; ComponentLink9Description: https://datasheet.ciiva.com/7673/1697337-7673321.pdf?src-supplier=Element14; ComponentLink10URL: https://datasheet.ciiva.com/16389/dcrcw-16389801.pdf?src-supplier=Future+Electronics; ComponentLink10Description: https://datasheet.ciiva.com/16389/dcrcw-16389801.pdf?src-supplier=Future+Electronics; ComponentLink11URL: https://datasheet.ciiva.com/22709/1697337-22709065.pdf?src-supplier=Element14; ComponentLink11Description: https://datasheet.ciiva.com/22709/1697337-22709065.pdf?src-supplier=Element14; ComponentLink12URL: https://datasheet.ciiva.com/7673/1697337-7673322.pdf?src-supplier=Element14; ComponentLink12Description: https://datasheet.ciiva.com/7673/1697337-7673322.pdf?src-supplier=Element14; ComponentLink13URL: https://datasheet.ciiva.com/5544/dcrcwe3-109170-5544861.pdf?src-supplier=Mouser; ComponentLink13Description: https://datasheet.ciiva.com/5544/dcrcwe3-109170-5544861.pdf?src-supplier=Mouser; ComponentLink14URL: https://datasheet.ciiva.com/7792/125364-7792397.pdf?src-supplier=Element14; ComponentLink14Description: https://datasheet.ciiva.com/7792/125364-7792397.pdf?src-supplier=Element14
R4 = CRCW060310K0FKEA: VISHAY - CRCW060310K0FKEA - SMD Chip Resistor, 0603 [1608 Metric], 10 kohm, CRCW e3 Series, 75 V, Thick Film, 100 mW; Resistance: 10kR; Power Rating: 100mW; Voltage Rating: 75V; Temperature Coefficient: 100ppm/°C; Tolerance: 1%; Supplier 1: Digi-Key; Supplier Part Number 1: 541-10.0KHCT-ND; Manufacturer: Vishay; Manufacturer Part Number: CRCW060310K0FKEA; RoHS: Yes; Category: Chip SMD Resistors; Pricing 1: 1=0,10000, 10=0,03400, 100=0,01390, 1000=0,00624, 2500=0,00542 (USD); Case/Package: 0603; Number of Pins: 2; Case Code (Metric): 1608; Case Code (Imperial): 0603; Contact Plating: Tin,Lead; Weight: 7.1E-05oz; Size Code: 0603; Min Operating Temperature: -55°C; Max Operating Temperature: 155°C; Packaging: Tape and Reel; Package Quantity: 10; Termination: SMD/SMT; Resistor Type: Thick Film; Series: CRCW; Resistance Tolerance: 1%; Max Power Dissipation: 100mW; Voltage Rating (DC): 75V; Number of Terminations: 2; Features: Automotive AEC-Q200; Construction: Rectangular; Technology: THICK FILM; Length: 1.55mm; Width: 0.033inch; Height: 0.45mm; Depth: 0.85mm; Radiation Hardening: No; REACH SVHC: Unknown; Military Standard: Not; Lead Free: Lead Free; RoHS Compliant: Yes; ComponentLink1URL: https://datasheet.ciiva.com/11809/0900766b80d98afc-11809037.pdf?src-supplier=RSComponents; ComponentLink1Description: https://datasheet.ciiva.com/11809/0900766b80d98afc-11809037.pdf?src-supplier=RSComponents; ComponentLink2URL: https://datasheet.ciiva.com/16886/dcrcw-16886037.pdf?src-supplier=Avnet+Europe; ComponentLink2Description: https://datasheet.ciiva.com/16886/dcrcw-16886037.pdf?src-supplier=Avnet+Europe; ComponentLink3URL: https://datasheet.ciiva.com/26821/getdatasheetpartid-86831-26821109.pdf?src-supplier=Verical; ComponentLink3Description: https://datasheet.ciiva.com/26821/getdatasheetpartid-86831-26821109.pdf?src-supplier=Verical; ComponentLink4URL: https://datasheet.ciiva.com/16754/70201119-16754710.pdf?src-supplier=Allied+Electronics; ComponentLink4Description: https://datasheet.ciiva.com/16754/70201119-16754710.pdf?src-supplier=Allied+Electronics; ComponentLink5URL: https://datasheet.ciiva.com/16719/70201119-16719704.pdf?src-supplier=Allied+Electronics; ComponentLink5Description: https://datasheet.ciiva.com/16719/70201119-16719704.pdf?src-supplier=Allied+Electronics; ComponentLink6URL: https://datasheet.ciiva.com/2465/dcrcwe3-2465513.pdf?src-supplier=Digi-Key; ComponentLink6Description: https://datasheet.ciiva.com/2465/dcrcwe3-2465513.pdf?src-supplier=Digi-Key; ComponentLink7URL: https://datasheet.ciiva.com/5543/dcrcwe3-109170-5543001.pdf?src-supplier=Mouser; ComponentLink7Description: https://datasheet.ciiva.com/5543/dcrcwe3-109170-5543001.pdf?src-supplier=Mouser; ComponentLink8URL: https://datasheet.ciiva.com/2465/dcrcwe3-2465514.pdf?src-supplier=Digi-Key; ComponentLink8Description: https://datasheet.ciiva.com/2465/dcrcwe3-2465514.pdf?src-supplier=Digi-Key; ComponentLink9URL: https://datasheet.ciiva.com/46385/1697337-46385498.pdf?src-supplier=Element14; ComponentLink9Description: https://datasheet.ciiva.com/46385/1697337-46385498.pdf?src-supplier=Element14; ComponentLink10URL: https://datasheet.ciiva.com/2465/dcrcwe3-2465515.pdf?src-supplier=Digi-Key; ComponentLink10Description: https://datasheet.ciiva.com/2465/dcrcwe3-2465515.pdf?src-supplier=Digi-Key; ComponentLink11URL: https://datasheet.ciiva.com/3256/dcrcwe3-3256939.pdf?src-supplier=Avnet; ComponentLink11Description: https://datasheet.ciiva.com/3256/dcrcwe3-3256939.pdf?src-supplier=Avnet; ComponentLink12URL: https://datasheet.ciiva.com/3256/dcrcwe3-3256940.pdf?src-supplier=Avnet; ComponentLink12Description: https://datasheet.ciiva.com/3256/dcrcwe3-3256940.pdf?src-supplier=Avnet; ComponentLink13URL: https://datasheet.ciiva.com/16209/dcrcwe3-16209164.pdf?src-supplier=Future+Electronics; ComponentLink13Description: https://datasheet.ciiva.com/16209/dcrcwe3-16209164.pdf?src-supplier=Future+Electronics; ComponentLink14URL: https://datasheet.ciiva.com/26314/fld-crcw-e3-data-en-26314749.pdf?src-supplier=Distrelec; ComponentLink14Description: https://datasheet.ciiva.com/26314/fld-crcw-e3-data-en-26314749.pdf?src-supplier=Distrelec
R5 = RC0603FR-07100KL: Res Thick Film 1.6 x 0.8 mm 100K Ohm 1% 0.1W(1/10W) 100ppm/ C Molded SMD Paper T/R; Manufacturer: Yageo; Temperature Coefficient: 100ppm/°C; Resistance: 100kR; Voltage Rating: 50V; Power Rating: 100mW; Working Voltage: 75V; Supplier 1: Digi-Key; Supplier Part Number 1: 311-100KHRCT-ND; Manufacturer Part Number: RC0603FR-07100KL; RoHS: Yes; Category: Chip SMD Resistors; Stock 1: 19742442; Pricing 1: 1=0,10000, 10=0,02400, 100=0,00970, 1000=0,00436, 2500=0,00378 (USD); Case/Package: 0603; Number of Pins: 2; Case Code (Imperial): 0603; Case Code (Metric): 1608; Min Operating Temperature: -55°C; Max Operating Temperature: 155°C; Tolerance: 1%; Packaging: Tape and Reel; Resistance Tolerance: 1%; Resistor Type: Thick Film; Series: RC; Termination: SMD/SMT; Number of Terminations: 2; Max Power Dissipation: 100mW; Features: Moisture Resistant; Voltage Rating (DC): 50V; Construction: Rectangular; Technology: THICK FILM; Length: 1.6mm; Width: 0.8mm; Height: 0.45mm; Depth: 0.8mm; REACH SVHC: No SVHC; RoHS Compliant: Yes; Lead Free: Lead Free; Military Standard: Not; ComponentLink1URL: https://datasheet.ciiva.com/11808/0900766b80f96399-11808107.pdf?src-supplier=RSComponents; ComponentLink1Description: https://datasheet.ciiva.com/11808/0900766b80f96399-11808107.pdf?src-supplier=RSComponents; ComponentLink2URL: https://datasheet.ciiva.com/7983/443971-7983593.pdf?src-supplier=Element14; ComponentLink2Description: https://datasheet.ciiva.com/7983/443971-7983593.pdf?src-supplier=Element14; ComponentLink3URL: https://datasheet.ciiva.com/46440/1868787-46440889.pdf?src-supplier=Element14; ComponentLink3Description: https://datasheet.ciiva.com/46440/1868787-46440889.pdf?src-supplier=Element14; ComponentLink4URL: https://datasheet.ciiva.com/7746/1738695-7746234.pdf?src-supplier=Element14; ComponentLink4Description: https://datasheet.ciiva.com/7746/1738695-7746234.pdf?src-supplier=Element14; ComponentLink5URL: https://datasheet.ciiva.com/7746/1738695-7746235.pdf?src-supplier=Element14; ComponentLink5Description: https://datasheet.ciiva.com/7746/1738695-7746235.pdf?src-supplier=Element14; ComponentLink6URL: https://datasheet.ciiva.com/22747/443971-22747516.pdf?src-supplier=Element14; ComponentLink6Description: https://datasheet.ciiva.com/22747/443971-22747516.pdf?src-supplier=Element14
R7 = CRCW06032K00FKEA: D11/CRCW0603 100 2K 1% ET1 e3; Manufacturer: Vishay; Power Rating: 100mW; Resistance: 2kR; Voltage Rating: 75V; Temperature Coefficient: 100ppm/°C; Supplier 1: Digi-Key; Supplier Part Number 1: 541-2.00KHCT-ND; Manufacturer Part Number: CRCW06032K00FKEA; RoHS: Yes; Category: Chip SMD Resistors; Stock 1: 244384; Pricing 1: 1=0,10000, 10=0,03400, 100=0,01390, 1000=0,00624, 2500=0,00542 (USD); Mount: Surface Mount; Case/Package: 0603; Number of Pins: 2; Case Code (Imperial): 0603; Case Code (Metric): 1608; Contact Plating: Tin,Lead; Size Code: 0603; Weight: 7.1E-05oz; Min Operating Temperature: -55°C; Max Operating Temperature: 155°C; Tolerance: 1%; Packaging: Tape and Reel; Resistor Type: Thick Film; Number of Terminations: 2; Max Power Dissipation: 100mW; Package Quantity: 10; Voltage Rating (DC): 75V; Series: CRCW; Termination: Solder; Resistance Tolerance: 1%; Construction: Rectangular; Features: Automotive AEC-Q200; Technology: THICK FILM; Length: 1.55mm; Width: 0.85mm; Height: 0.45mm; Depth: 0.85mm; Radiation Hardening: No; REACH SVHC: Unknown; RoHS Compliant: Yes; Lead Free: Lead Free; Military Standard: Not; ComponentLink1URL: https://datasheet.ciiva.com/7673/1720486-7673525.pdf?src-supplier=Element14; ComponentLink1Description: https://datasheet.ciiva.com/7673/1720486-7673525.pdf?src-supplier=Element14; ComponentLink2URL: https://datasheet.ciiva.com/28621/125364-28621397.pdf?src-supplier=Element14; ComponentLink2Description: https://datasheet.ciiva.com/28621/125364-28621397.pdf?src-supplier=Element14; ComponentLink3URL: https://datasheet.ciiva.com/3257/dcrcwe3-3257366.pdf?src-supplier=Avnet; ComponentLink3Description: https://datasheet.ciiva.com/3257/dcrcwe3-3257366.pdf?src-supplier=Avnet; ComponentLink4URL: https://datasheet.ciiva.com/3257/dcrcwe3-3257367.pdf?src-supplier=Avnet; ComponentLink4Description: https://datasheet.ciiva.com/3257/dcrcwe3-3257367.pdf?src-supplier=Avnet; ComponentLink5URL: https://datasheet.ciiva.com/16882/dcrcw-16882855.pdf?src-supplier=Avnet+Europe; ComponentLink5Description: https://datasheet.ciiva.com/16882/dcrcw-16882855.pdf?src-supplier=Avnet+Europe; ComponentLink6URL: https://datasheet.ciiva.com/5551/dcrcwe3-109170-5551994.pdf?src-supplier=Mouser; ComponentLink6Description: https://datasheet.ciiva.com/5551/dcrcwe3-109170-5551994.pdf?src-supplier=Mouser; ComponentLink7URL: https://datasheet.ciiva.com/16755/70201119-16755770.pdf?src-supplier=Allied+Electronics; ComponentLink7Description: https://datasheet.ciiva.com/16755/70201119-16755770.pdf?src-supplier=Allied+Electronics; ComponentLink8URL: https://datasheet.ciiva.com/26314/fld-crcw-e3-data-en-26314682.pdf?src-supplier=Distrelec; ComponentLink8Description: https://datasheet.ciiva.com/26314/fld-crcw-e3-data-en-26314682.pdf?src-supplier=Distrelec; ComponentLink9URL: https://datasheet.ciiva.com/2465/dcrcwe3-2465564.pdf?src-supplier=Digi-Key; ComponentLink9Description: https://datasheet.ciiva.com/2465/dcrcwe3-2465564.pdf?src-supplier=Digi-Key; ComponentLink10URL: https://datasheet.ciiva.com/16765/70201119-16765388.pdf?src-supplier=Allied+Electronics; ComponentLink10Description: https://datasheet.ciiva.com/16765/70201119-16765388.pdf?src-supplier=Allied+Electronics; ComponentLink11URL: https://datasheet.ciiva.com/2465/dcrcwe3-2465565.pdf?src-supplier=Digi-Key; ComponentLink11Description: https://datasheet.ciiva.com/2465/dcrcwe3-2465565.pdf?src-supplier=Digi-Key; ComponentLink12URL: https://datasheet.ciiva.com/2465/dcrcwe3-2465566.pdf?src-supplier=Digi-Key; ComponentLink12Description: https://datasheet.ciiva.com/2465/dcrcwe3-2465566.pdf?src-supplier=Digi-Key
R8 = RC0603FR-076K81L: RES SMD 6.81K OHM 1% 1/10W 0603; Manufacturer: Yageo; Resistance: 6.81kR; Power Rating: 100mW; Voltage Rating (DC): 50V; Temperature Coefficient: 100ppm/°C; Supplier 1: Digi-Key; Supplier Part Number 1: 311-6.81KHRCT-ND; Manufacturer Part Number: RC0603FR-076K81L; RoHS: Yes; Category: Chip SMD Resistors; Stock 1: 635161; Pricing 1: 1=0,10000, 10=0,02400, 100=0,00970, 1000=0,00436, 2500=0,00378 (USD); Case/Package: 0603; Case Code (Imperial): 0603; Case Code (Metric): 1608; Size Code: 0603; Min Operating Temperature: -55°C; Max Operating Temperature: 155°C; Packaging: Tape and Reel; Termination: SMD/SMT; Tolerance: 1%; Max Power Dissipation: 100mW; Voltage Rating: 50V; Resistor Type: Thick Film; Series: RC; Number of Terminations: 2; Features: Moisture Resistant; Construction: Rectangular; Length: 1.6mm; Depth: 0.8mm; Lead Free: Lead Free; RoHS Compliant: Yes; Military Standard: Not; ComponentLink1URL: https://datasheet.ciiva.com/15189/getdatasheetpartid-331153-15189810.pdf?src-supplier=Verical; ComponentLink1Description: https://datasheet.ciiva.com/15189/getdatasheetpartid-331153-15189810.pdf?src-supplier=Verical
U1 = LM5161PWPR: IC REG BCK FLYBCK ISO 14HTSSOP; Manufacturer: Texas Instruments; Output Current: 1A; Switching Frequency: 1MHz; Quiescent Current: 2.3mA; Number of Outputs: 1; Min Input Voltage: 4.5V; Max Input Voltage: 100V; Min Output Voltage: 2V; Max Output Voltage: 92V; Synchronous Rectifier: Yes; Topology: Flyback; Output Type: Adjustable; Supplier 1: Digi-Key; Supplier Part Number 1: 296-47265-1-ND; Manufacturer Part Number: LM5161PWPR; RoHS: Yes; Category: Voltage Regulators - Switching; Stock 1: 1170; Pricing 1: 1=4,45000, 10=3,99600, 25=3,77800, 100=3,10620, 250=2,78720, 500=2,68646, 1000=2,23312 (USD); Mount: Surface Mount; Min Operating Temperature: -40°C; Max Operating Temperature: 125°C; Packaging: Tape and Reel; Lead Free: Lead Free; RoHS Compliant: Yes; ComponentLink1URL: http://www.ti.com/lit/ds/symlink/lm5161.pdf?src-supplier=Digi-Key; ComponentLink1Description: http://www.ti.com/lit/ds/symlink/lm5161.pdf?src-supplier=Digi-Key